# EAGLE design sim (EAGLE 4.13)
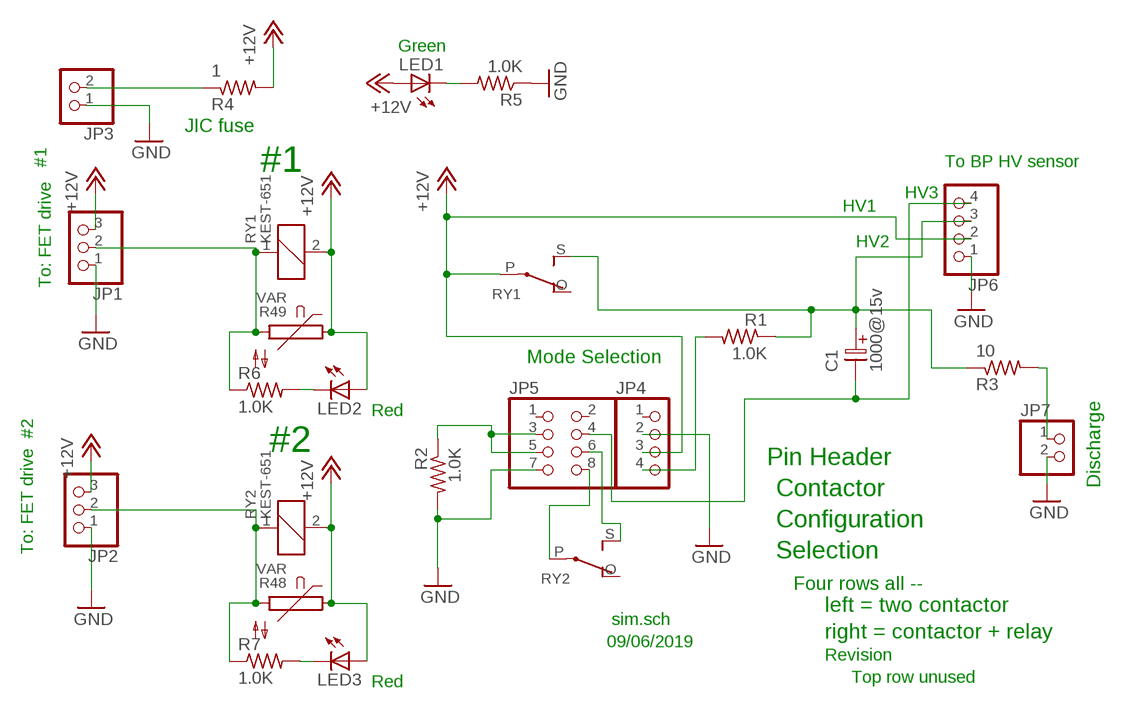
[diagram p0: schematic, sheet 1]

## Parts
C1  1000@15v  ELC-2,5L  [ES-2,5L]
JP1  PINHD-1X3  [1X03]
JP2  PINHD-1X3  [1X03]
JP3  PINHD-1X2  [1X02]
JP4  PINHD-1X4  [1X04]
JP5  PINHD-2X4  [2X04]
JP6  PINHD-1X4  [1X04]
JP7  PINHD-1X2  [1X02]
LED1  LEDCHIPLED_0805  [CHIPLED_0805]
LED2  LEDCHIPLED_0805  [CHIPLED_0805]
LED3  LEDCHIPLED_0805  [CHIPLED_0805]
R1  1.0K  R-US_R0603  [R0603]
R2  1.0K  R-US_R0603  [R0603]
R3  10  R-US_R0603  [R0603]
R4  1  R-US_R0603  [R0603]
R5  1.0K  R-US_R0603  [R0603]
R6  1.0K  R-US_R0603  [R0603]
R7  1.0K  R-US_R0603  [R0603]
R48  VAR  S05K40  [S05K40]
R49  VAR  S05K40  [S05K40]
RY1  KEST-651  [KEST-651]
RY2  KEST-651  [KEST-651]

## Nets
+12V: JP1.3 JP2.3 JP4.3 JP6.2 LED1.A LED2.A LED3.A R4.2 R48.1 R49.1 RY1.2 RY1.P RY2.2
GND: JP1.1 JP2.1 JP3.1 JP4.2 JP5.7 JP6.1 JP7.2 R2.2 R5.1
INPUT_12V: JP3.2 R4.1
LED1: LED1.C R5.2
LED2: LED2.C R6.2
N$1: JP5.8 RY2.P
N$2: JP1.2 R6.1 R49.2 RY1.1
N$3: JP2.2 R7.1 R48.2 RY2.1
N$4: JP5.6 RY2.S
N$5: JP4.4 R1.2
N$6: C1.2 JP5.4 JP6.4
N$7: C1.1 JP6.3 R1.1 R3.1 RY1.S
N$9: JP7.1 R3.2
N$10: JP5.3 JP5.5 R2.1
N$12: LED3.C R7.2
Unconnected: JP4.1 JP5.1 JP5.2 RY1.O RY2.O

## Notes on the sheet
- Green
- JIC fuse
- #1 | #1 | To BP HV sensor
- HV3
- HV1
- HV2
- To: FET drive
- Mode Selection
- Red
- #2
- #2
- Pin Header
- Discharge
- Contactor
- Configuration
- To: FET drive | Selection
- Four rows all --
- left = two contactor
- sim.sch
- right = contactor + relay
- 09/06/2019
- Revision
- Red | Top row unused

## Library data of the parts
C1 = DEH:ELC-2,5L
JP1 JP2 = pinhead:PINHD-1X3: PIN HEADER
JP3 JP7 = pinhead:PINHD-1X2: PIN HEADER
JP4 JP6 = pinhead:PINHD-1X4: PIN HEADER
JP5 = pinhead:PINHD-2X4: PIN HEADER
LED1-LED3 = led:LED: LED OSRAM: - CHIPLED LG R971, LG N971, LY N971, LG Q971, LY Q971, LO R971, LY R971 LH N974, LH R974 LS Q976, LO Q976, LY Q976 LO Q996 - Hyper CHIPLED LW Q18S LB Q993, LB Q99A, LB R99A - SideLED LS A670, LO A670, LY A670, LG A670, LP A670 LB A673, LV A673, LT A673, LW A673 LH A674 LY A675 LS A676, LA A676, LO A676, LY A676, LW A676 LS A679, LY A679, LG A679 - Hyper Micro SIDELED® LS Y876, LA Y876, LO Y876, LY Y876 LT Y87S - SmartLED LW L88C, LW L88S LB L89C, LB L89S, LG L890 LS L89K, LO L89K, LY L89K LS L896, LA L896, LO L896, LY L896 - TOPLED LS T670, LO T670, LY T670, LG T670, LP T670 LSG T670, LSP T670, LSY T670, LOP T670, LYG T670 LG T671, LOG T671, LSG T671 LB T673, LV T673, LT T673, LW T673 LH T674 LS T676, LA T676, LO T676, LY T676, LB T676, LH T676, LSB T676, LW T676 LB T67C, LV T67C, LT T67C, LS T67K, LO T67K, LY T67K, LW E67C LS E67B, LA E67B, LO E67B, LY E67B, LB E67C, LV E67C, LT E67C LW T67C LS T679, LY T679, LG T679 LS T770, LO T770, LY T770, LG T770, LP T770 LB T773, LV T773, LT T773, LW T773 LH T774 LS E675, LA E675, LY E675, LS T675 LS T776, LA T776, LO T776, LY T776, LB T776 LHGB T686 LT T68C, LB T68C - Hyper Mini TOPLED® LB M676 - Mini TOPLED Santana® LG M470 LS M47K, LO M47K, LY M47K Source: http://www.osram.convergy.de/
R1-R7 = rcl:R-US_: RESISTOR, American symbol
R48 R49 = VARIST:S05K40
RY1 RY2 = RELAIS:KEST-651

## Board
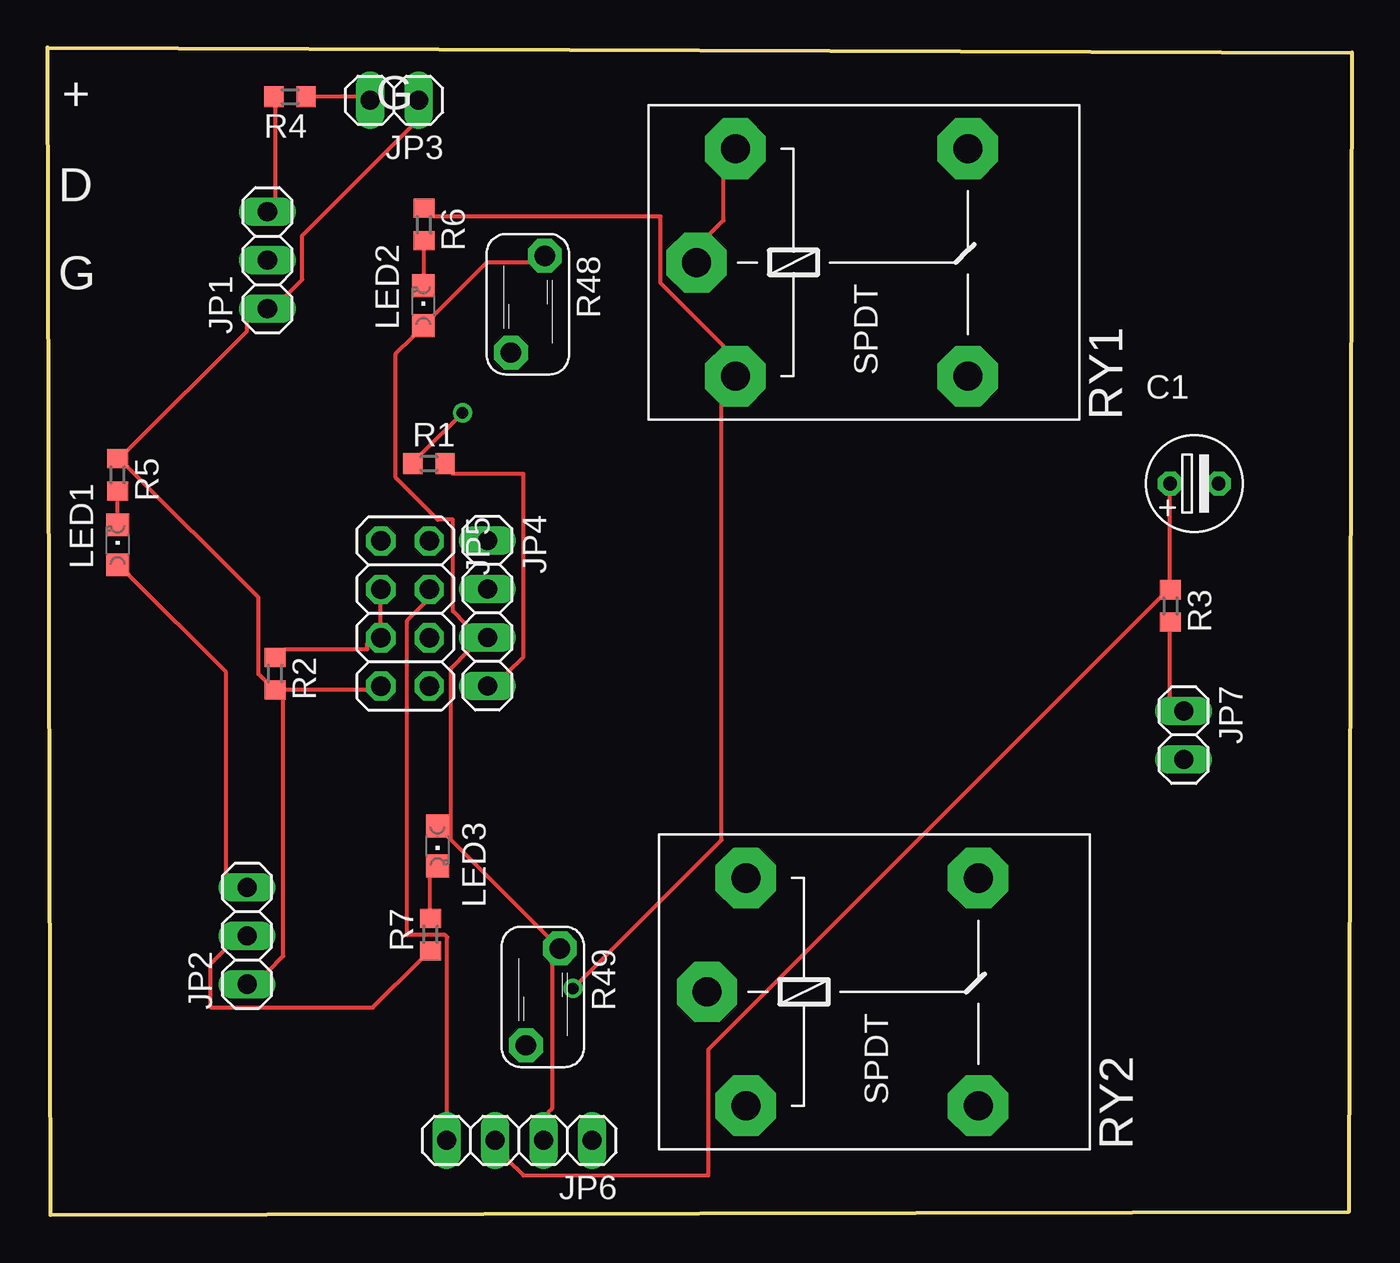
[diagram p1: board, top side]
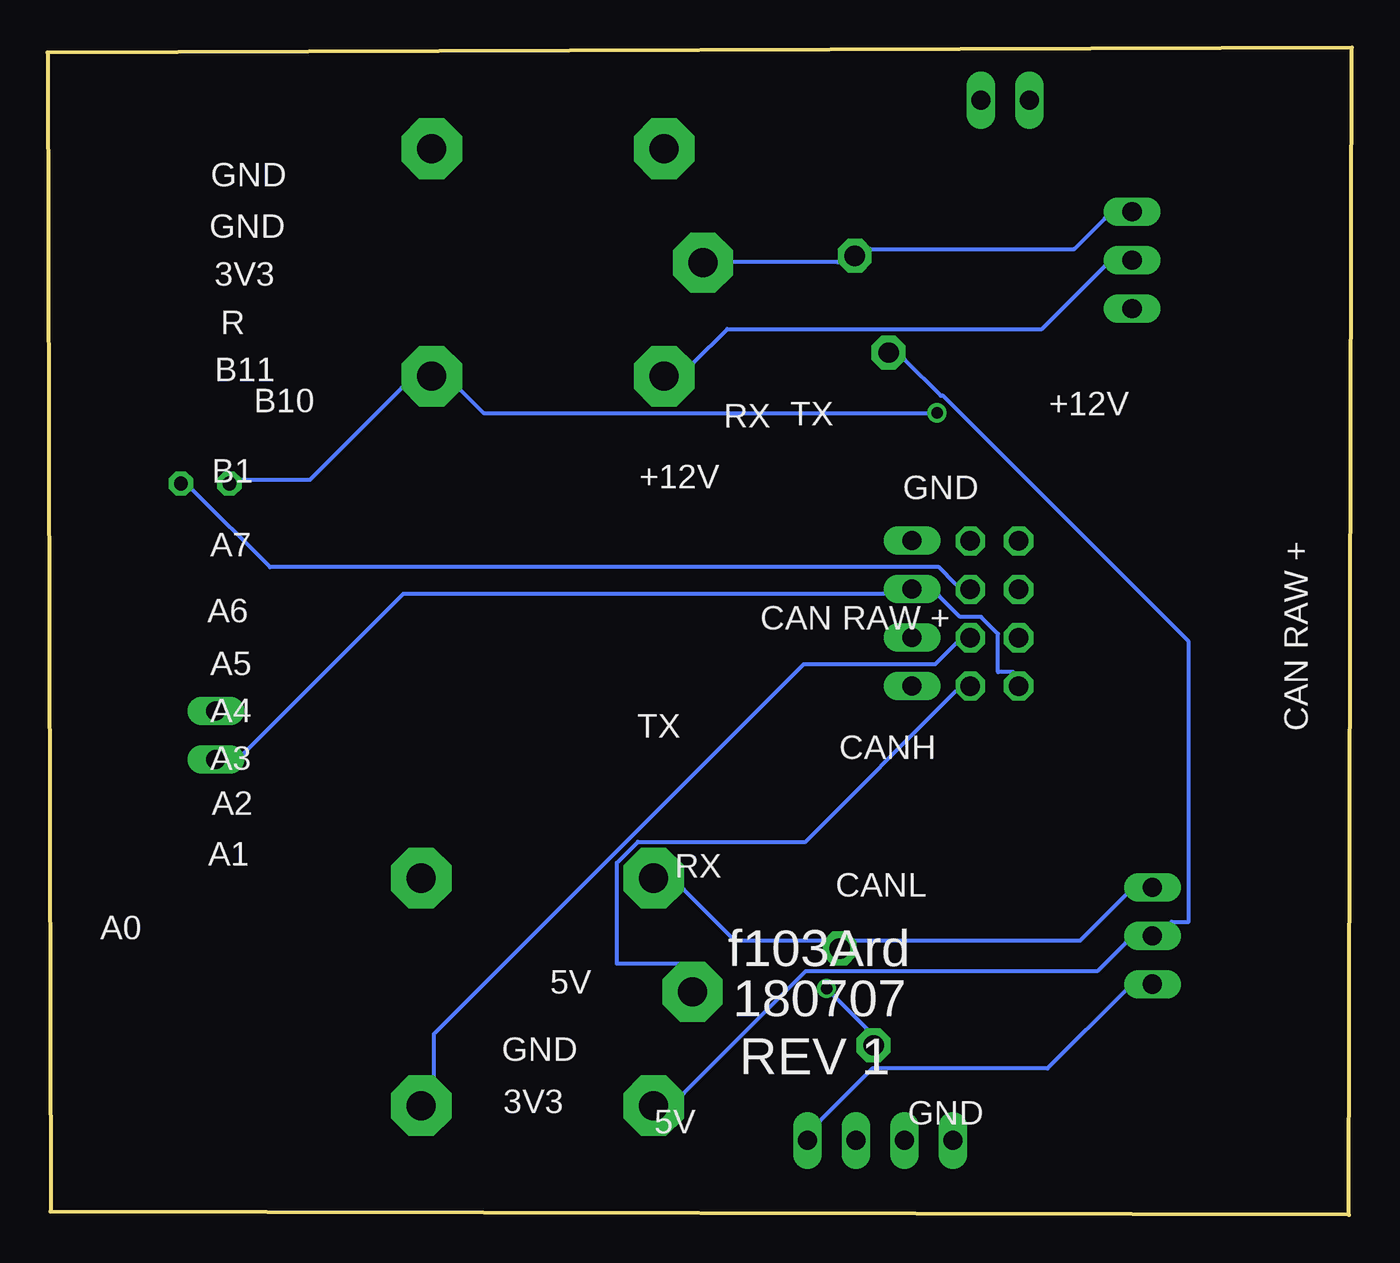
[diagram p2: board, bottom side, seen from below]

Size 68.42 x 61.24 mm. Coordinates in mm from the lower left corner, seen from the top.
Outline: 0.16,0 0,61.24 68.42,60.98 68.27,0.17 0.16,0
Copper layers (1*16): Top 0.035mm / dielectric 0.2032mm / Bottom 0.035mm
Design rules "default": minimum track width 8mil, minimum drill 0.6mm, track to track 8mil, track to pad 8mil, pad to pad 10mil, via to via 8mil, smd to smd 0mil, copper to edge 8mil, drill to drill 8mil, minimum pad ring 8mil, minimum via ring 8mil, stop-mask expansion 4mil, vias tented up to drill 0mil, thermal gap 10mil

### Footprints (pad centres in the part's own frame; a part is rotated, then mirrored left to right if it is on the bottom)
ES-2,5L = drill 0.711 pad 1.27 octagon: 1 0,0; 2 2.54,0
1X03 = drill 1 long: 1 -2.54,0; 2 0,0; 3 2.54,0
1X02 = drill 1 long: 1 -1.27,0; 2 1.27,0
1X04 = drill 1 long: 1 -3.81,0; 2 -1.27,0; 3 1.27,0; 4 3.81,0
2X04 = drill 1.016 octagon: 1 -3.81,-1.27; 2 -3.81,1.27; 3 -1.27,-1.27; 4 -1.27,1.27; 5 1.27,-1.27; 6 1.27,1.27; 7 3.81,-1.27; 8 3.81,1.27
CHIPLED_0805 = smd 1.2 x 1.2: A 0,-1.05; C 0,1.05
R0603 = smd 1 x 1.1: 1 -0.85,0; 2 0.85,0
S05K40 = drill 1.067 pad 1.778 octagon: 1 -0.889,-2.54; 2 0.889,2.54
KEST-651 = drill 1.524 pad 3.175 octagon: 1 1.932,-6.069; 2 1.932,5.869; O 14.124,5.869; S 14.124,-6.069 | drill 1.524 pad 3.15 octagon: P -0.1,-0.1

### Placement (x,y rotation side)
C1  58.89,38.37 0 top
JP1  11.53,50.09 90 top
JP2  10.46,14.65 90 top
JP3  18.18,58.48 180 top
JP4  23.07,31.57 270 top
JP5  18.75,31.55 270 top
JP6  24.74,3.91 180 top
JP7  59.6,25.17 270 top
LED1  3.67,35.16 0 top
LED2  19.71,47.71 0 top
LED3  20.45,19.36 180 top
R1  20.01,39.42 0 top
R2  11.93,28.4 270 top
R3  58.9,31.95 270 top
R4  12.72,58.66 180 top
R5  3.67,38.83 270 top
R6  19.74,51.96 270 top
R7  20.08,14.71 90 top
R48  25.19,47.78 180 top
R49  25.98,11.44 180 top
RY1  34.15,50.07 0 top
RY2  34.7,11.8 0 top

### Tracks (layer width: path | path; a pad name or v marks a point on that pad's centre or on a via)
+12V
  Top 0.203: RY1.P 34.76,51.48 35.46,52.18 35.46,54.38 RY1.2 | R4.2 11.96,58.18 11.96,53.28 JP1.3 | R48.1 25.26,49.98 23.06,49.98 20.26,47.18 LED2.A 19.16,46.08 18.26,45.18 18.26,38.68 20.46,36.48 21.26,36.48 21.26,31.68 21.96,30.98 JP4.3 22.06,29.58 21.16,28.68 21.16,19.78 21.11,19.73 | LED1.A 4.26,33.58 9.36,28.48 9.36,17.88 JP2.3 | 21.11,19.73 26.26,14.58 R49.1 26.46,13.18 26.46,5.58 26.26,5.38 JP6.2 | 21.11,19.73 20.96,19.88 LED3.A
  Bottom 0.203: JP1.3 12.96,52.28 14.56,50.68 25.26,50.68 R48.1 26.96,49.98 32.56,49.98 RY1.P | RY2.2 35.06,17.08 32.36,14.38 27.66,14.38 R49.1 26.06,14.38 14.26,14.38 11.86,16.78 JP2.3
GND
  Top 0.203: JP3.1 19.06,57.08 13.36,51.38 13.36,49.08 12.56,48.28 JP1.1 10.46,46.88 10.46,46.38 4.16,40.08 R5.1 4.16,39.28 11.06,32.38 11.06,28.38 11.46,27.98 R2.2 | R2.2 12.46,27.58 16.76,27.58 JP5.7 | JP2.1 11.56,12.78 12.36,13.58 12.36,27.08 R2.2
  Bottom 0.203: JP6.1 27.86,4.98 25.16,7.68 15.96,7.68 11.86,11.78 JP2.1 | JP5.7 17.76,28.48 18.56,28.48 18.56,30.48 19.46,31.38 20.56,31.38 21.66,32.48 JP4.2 24.56,32.58 49.76,32.58 58.16,24.18 JP7.2
INPUT_12V
  Top 0.203: R4.1 14.06,58.68 16.26,58.68 JP3.2
LED1
  Top 0.203: R5.2 3.66,37.58 3.66,36.78 LED1.C
LED2
  Top 0.203: R6.2 19.76,50.68 19.76,49.28 LED2.C
N$1
  Bottom 0.203: JP5.8 20.76,27.48 28.66,19.58 37.46,19.58 38.56,18.48 38.56,13.18 35.26,13.18 RY2.P
N$2  (via drill 0.6)
  Top 0.203: R6.1 20.26,52.38 32.16,52.38 32.16,48.88 35.46,45.58 RY1.1 35.36,42.48 35.36,19.68 v27.56,11.88
  Bottom 0.203: JP1.2 12.96,49.78 16.26,46.48 32.76,46.48 34.56,44.68 RY1.1 | v27.56,11.88 25.46,9.78 R49.2
N$3
  Top 0.203: R7.1 19.56,13.38 17.06,10.88 8.56,10.88 8.56,13.18 9.36,13.98 JP2.2
  Bottom 0.203: R48.2 23.46,44.88 21.56,42.98 21.46,42.98 8.56,30.08 8.56,15.38 9.46,15.38 JP2.2 11.86,14.28 13.36,12.78 28.66,12.78 35.06,6.38 RY2.1
N$4
  Bottom 0.203: JP5.6 20.76,29.98 21.86,28.88 28.76,28.88 48.16,9.48 48.16,7.28 RY2.S
N$5
  Top 0.203: R1.2 21.26,38.88 24.96,38.88 24.96,29.28 24.16,28.48 JP4.4
N$6
  Top 0.203: JP6.4 20.96,5.38 20.96,14.58 20.86,14.68 18.86,14.68 18.86,31.18 19.76,32.08 JP5.4
  Bottom 0.203: C1.2 60.86,38.08 56.76,33.98 21.66,33.98 20.76,33.08 JP5.4
N$7  (via drill 0.6)
  Top 0.203: v21.76,42.08 19.56,39.88 R1.1 | C1.1 58.86,37.78 58.86,33.28 R3.1 58.36,32.38 34.66,8.68 34.66,2.08 24.96,2.08 24.16,2.88 JP6.3
  Bottom 0.203: v21.76,42.08 45.56,42.08 46.76,43.28 RY1.S 49.86,43.38 54.66,38.58 58.26,38.58 C1.1
N$9
  Top 0.203: R3.2 58.86,30.68 58.86,27.18 JP7.1
N$10
  Top 0.203: R2.1 12.46,29.68 16.76,29.68 16.76,29.98 JP5.5 17.46,30.98 17.46,32.08 JP5.3
N$12
  Top 0.203: R7.2 20.06,15.98 20.06,17.78 LED3.C

### Text on the board
tNames: + | G | D | G
bNames: GND | GND | 3V3 | DIV2 | R | B9BUF | B7BUF | B11 | +12V | B10 | DIV6 | TX | RX | GND | +12V | B1 | CAN RAW + | A7 | 12V | 5V | CAN RAW + | A6 | A5 | A4 | TX | CANH | A3 | A2 | RX | A1 | CANL | A0 | f103Ard | 5V | B8BUF | B5BUF | DIV1 | 180707 | DIV5 | GND | REV 1 | GND | 3V3 | 5V | 5V | 5V
bStop: f103Ard | 07/01/2018